# Altium schematic sheet Motor-Supply-Section.SchDoc
size A4; DocumentNumber: 4; SheetNumber: 4; SheetTotal: 10
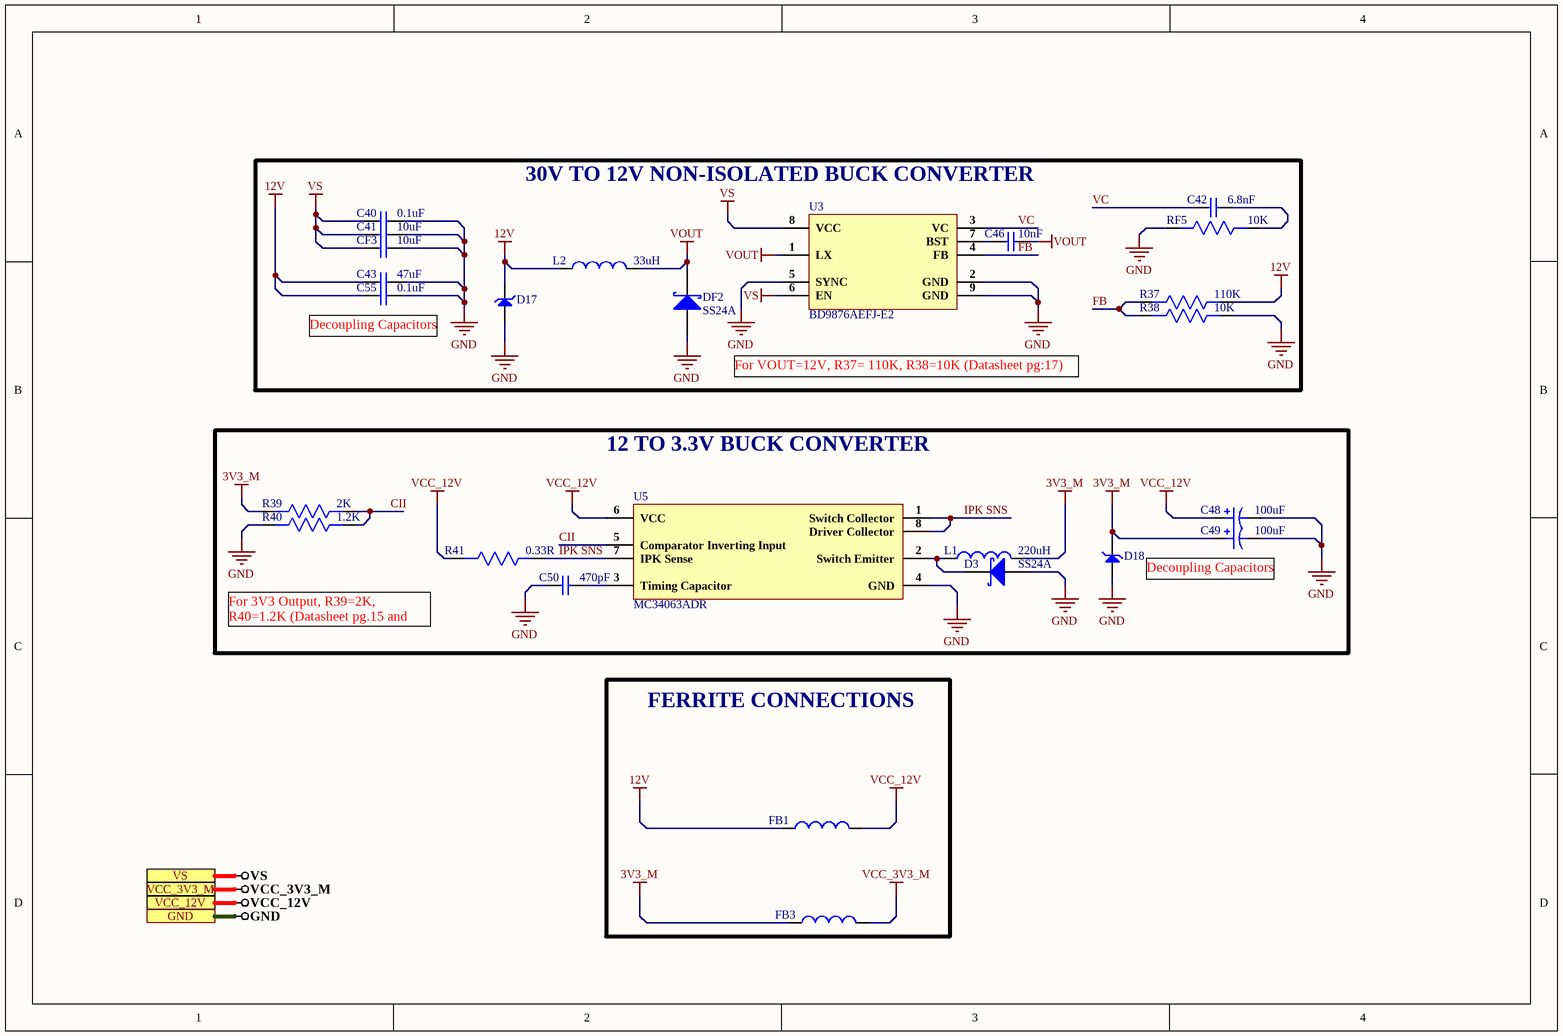
[diagram p0: Motor-Supply-Section.SchDoc]

## Parts
C40  0.1uF  [Cap 0603]
C41  10uF  [Cap 0603]
C42  6.8nF  [Cap 0603]
C43  47uF  [Cap1206]
C46  10nF  [Cap 0402]
C48  100uF  [CAP- 2917]
C49  100uF  [CAP- 2917]
C50  470pF  [Cap 0603]
C55  0.1uF  [Cap 0603]
CF3  10uF  [Cap 0603]
D3  SS24A  [SMA]
D17  MSMP12A-M3/89A  [MicroSMP]  (value not drawn)
D18  MSP3V3HM3/89A  [MicroSMP]  (value not drawn)
DF2  SS24A  [SMA]
FB1  MPZ1608S121ATDH5  [MPZ1608S121ATDH5]  (value not drawn)
FB3  MPZ1608S121ATDH5  [MPZ1608S121ATDH5]  (value not drawn)
L1  220uH  [SLF12575T-221M1R3-PF]
L2  33uH  [PNLS5020-330]
R37  110K  [Res0603]
R38  10K  [Res0603]
R39  2K  [Res0603]
R40  1.2K  [Res0603]
R41  0.33R  [Res0603]
RF5  10K  [Res0603]
U3  BD9876AEFJ-E2  [8-HTSOP-J]
U5  MC34063ADR  [SOIC-8]

## Blocks framed on the sheet
30V TO 12V NON-ISOLATED BUCK CONVERTER: C40-C43 C46 C55 CF3 D17 DF2 L2 R37 R38 RF5 U3
12 TO 3.3V BUCK CONVERTER: C48-C50 D3 D18 L1 R39-R41 U5
FERRITE CONNECTIONS: FB1 FB3

## Ports
GND, VCC_3V3_M, VCC_12V, VS

## Nets
3V3_M: C49.1 D18.2(K) FB3.1 L1.2 R39.2
12V: C43.1 C55.1 D17.2(K) FB1.1 L2.1 R37.1
GND: C40.2 C41.2 C43.2 C48.2 C49.2 C50.1 C55.2 CF3.2 D3.2(A) D17.1(A) D18.1(A) DF2.2(A) R38.1 R40.2 RF5.2 U3.2(GND) U3.5(SYNC) U3.9(GND) U5.4(GND) ; port GND
VCC_3V3_M: FB3.2 ; port VCC_3V3_M
VCC_12V: C48.1 FB1.2 R41.2 U5.6(VCC) ; port VCC_12V
VOUT: C46.2 DF2.1(K) L2.2 U3.1(LX)
VS: C40.1 C41.1 CF3.1 U3.6(EN) U3.8(VCC) ; port VS
CII: R39.1 R40.1 U5.5(Comparator_Inverting_Input)
FB: R37.2 R38.2 U3.4(FB)
IPK SNS: R41.1 U5.1(Switch_Collector) U5.7(IPK_Sense) U5.8(Driver_Collector)
VC: C42.1 U3.3(VC)
NetC42_2: C42.2 RF5.1
NetC46_1: C46.1 U3.7(BST)
NetC50_2: C50.2 U5.3(Timing_Capacitor)
NetD3_1: D3.1(K) L1.1 U5.2(Switch_Emitter)

## Notes on the sheet
- Decoupling Capacitors
- For VOUT=12V, R37= 110K, R38=10K (Datasheet pg:17)
- For 3V3 Output, R39=2K, R40=1.2K (Datasheet pg.15 and pg.16)

## Library data of the parts
C40 C55 = CL10B104KB8NNNC: Cap Ceramic 0.1uF 50VDC X7R 10% SMD 0603 Paper T/R; Manufacturer: Samsung; Capacitance: 100nF; Voltage Rating: 50V; Supplier 1: Digi-Key; Manufacturer Part Number: CL10B104KB8NNNC; RoHS: Yes; Category: Ceramic Capacitors; Stock 1: 3998791; Pricing 1: 1=0.10000, 10=0.03000, 50=0.01640, 100=0.01340, 500=0.00954, 1000=0.00750 (USD); Mount: Surface Mount; Case/Package: 0603; Case Code (Metric): 1608; Case Code (Imperial): 0603; Material: Ceramic; Contact Plating: Tin; Min Operating Temperature: -55°C; Max Operating Temperature: 125°C; Dielectric: X7R; Tolerance: 10%; Package Quantity: 1; Packaging: Tape and Reel; Voltage: 50V; Voltage Rating (DC): 50V; Series: CL; Construction: Flat; Length: 1.6mm; Width: 0.031inch; Height: 0.8mm; Depth: 0.8mm; Thickness: 0.035inch; Radiation Hardening: No; Lead Free: Lead Free; RoHS Compliant: Yes; ComponentLink1URL: https://datasheet.ciiva.com/25803/cl10b104kb8nnnc-25803393.pdf?src-supplier=Digi-Key; ComponentLink1Description: https://datasheet.ciiva.com/25803/cl10b104kb8nnnc-25803393.pdf?src-supplier=Digi-Key; ComponentLink2URL: https://datasheet.ciiva.com/26838/getdatasheetpartid-89097-26838411.pdf?src-supplier=Verical; ComponentLink2Description: https://datasheet.ciiva.com/26838/getdatasheetpartid-89097-26838411.pdf?src-supplier=Verical; ComponentLink3URL: https://datasheet.ciiva.com/29198/456651-da-01-en-vs-kondensator-0605-29198839.pdf?src-supplier=Conrad; ComponentLink3Description: https://datasheet.ciiva.com/29198/456651-da-01-en-vs-kondensator-0605-29198839.pdf?src-supplier=Conrad; Supplier Part Number 1: 1276-1000-1-ND
C41 CF3 = GRM188R6YA106MA73D: 10uF 35V X5R 20% Pad SMD 0603; Manufacturer: Murata; Supplier 1: Arrow Electronics; Manufacturer Part Number: GRM188R6YA106MA73D; RoHS: Yes; Category: Ceramic Capacitors; Stock 1: 37601; Pricing 1: 1=0.36650, 10=0.23380, 25=0.23160, 100=0.15050, 250=0.14890, 500=0.10700, 1000=0.09270, 3000=0.08640, 6000=0.07720, 15000=0.07140, 30000=0.05840 (USD); Mount: Surface Mount; Case/Package: 0603; Case Code (Metric): 1608; Case Code (Imperial): 0603; Min Operating Temperature: -55°C; Max Operating Temperature: 85°C; Packaging: Tape and Reel; Capacitance: 10uF; Voltage Rating: 35V; Tolerance: 20%; Voltage Rating (DC): 35V; Dielectric: X5R; Length: 0.063inch; Width: 0.031inch; Thickness: 0.039inch; RoHS Compliant: Yes; ComponentLink1URL: http://search.murata.co.jp/Ceramy/image/img/A01X/G101/ENG/GRM188R6YA106MA73-01.pdf?src-supplier=Future+Electronics; ComponentLink1Description: http://search.murata.co.jp/Ceramy/image/img/A01X/G101/ENG/GRM188R6YA106MA73-01.pdf?src-supplier=Future+Electronics; ComponentLink2URL: http://search.murata.co.jp/Ceramy/image/img/A01X/G101/ENG/GRM188R6YA106MA73-01.pdf?src-supplier=Digi-Key; ComponentLink2Description: http://search.murata.co.jp/Ceramy/image/img/A01X/G101/ENG/GRM188R6YA106MA73-01.pdf?src-supplier=Digi-Key; ComponentLink3URL: https://www.murata.com/~/media/webrenewal/support/library/catalog/products/capacitor/mlcc/c02e.ashx?la=en-us&src-supplier=Digi-Key; ComponentLink3Description: https://www.murata.com/~/media/webrenewal/support/library/catalog/products/capacitor/mlcc/c02e.ashx?la=en-us&src-supplier=Digi-Key; ComponentLink4URL: http://search.murata.co.jp/Ceramy/image/img/A01X/G101/ENG/GRM188R6YA106MA73-01.pdf?src-supplier=Mouser; ComponentLink4Description: http://search.murata.co.jp/Ceramy/image/img/A01X/G101/ENG/GRM188R6YA106MA73-01.pdf?src-supplier=Mouser; ComponentLink5URL: http://search.murata.co.jp/Ceramy/image/img/A01X/G101/ENG/GRM188R6YA106MA73-01.pdf?src-supplier=TTI; ComponentLink5Description: http://search.murata.co.jp/Ceramy/image/img/A01X/G101/ENG/GRM188R6YA106MA73-01.pdf?src-supplier=TTI; Supplier Part Number 1: GRM188R6YA106MA73D
C42 = 0603B682K500NT: 50V 6.8nF X7R ±10% 0603; Manufacturer: FH; ComponentLink1Description: LCSC; ComponentLink1URL: https://www.lcsc.com/product-detail/Multilayer-Ceramic-Capacitors-MLCC-SMD-SMT_FH-Guangdong-Fenghua-Advanced-Tech-0603B682K500NT_C1631.html; Manufacturer Part Number: 0603B682K500NT; Footprint: 0603; Value: 6.8nF
C43 = GRM31CR61E476ME44L: CAP CER 1206 47 uF 25 V ±20 % Tol. X5R; Manufacturer: Murata; Tolerance: 20%; Voltage Rating (DC): 25V; Supplier 1: Digi-Key; Manufacturer Part Number: GRM31CR61E476ME44L; RoHS: Yes; Category: Ceramic Capacitors; Capacitance: 47uF; Dielectric: X5R; Length: 3.2mm; Width: 1.6mm; Thickness: 1.6mm; ComponentLink1URL: https://search.murata.co.jp/Ceramy/image/img/A01X/partnumbering_e_01.pdf?src-supplier=Digi-Key; ComponentLink1Description: https://search.murata.co.jp/Ceramy/image/img/A01X/partnumbering_e_01.pdf?src-supplier=Digi-Key; Supplier Part Number 1: 490-16268-2-ND
C46 = CC0402KRX7R8BB103: CAP CER 10000PF 25V X7R 0402; Manufacturer: Yageo; Tolerance: 10%; Supplier 1: Digi-Key; Manufacturer Part Number: CC0402KRX7R8BB103; Stock 1: 0; Pricing 1: 1=0.1, 10=0.021, 100=0.0093, 500=0.00666, 1000=0.00523, 2500=0.00476, 5000=0.00438 (USD); Mount: Surface Mount; Case/Package: 0402; Case Code (Metric): 1005; Case Code (Imperial): 0402; Min Operating Temperature: -55°C; Max Operating Temperature: 125°C; Capacitance: 10nF; Dielectric: X7R; Voltage Rating: 25V; Package Quantity: 1; Packaging: Tape and Reel; Voltage Rating (DC): 25V; Termination: SMD/SMT; Composition: Ceramic; Length: 1mm; Height: 0.5mm; Depth: 0.5mm; Width: 0.02inch; Thickness: 0.022inch; Radiation Hardening: No; REACH SVHC: Unknown; Lead Free: Lead Free; Halogen Free: Halogen Free; ComponentLink1URL: http://www.yageo.com/documents/recent/UPY-GPHC_X7R_6.3V-to-50V_18.pdf?src-supplier=Digi-Key; ComponentLink1Description: http://www.yageo.com/documents/recent/UPY-GPHC_X7R_6.3V-to-50V_18.pdf?src-supplier=Digi-Key; ComponentLink2URL: https://www.verical.com/server-webapp/html/getDatasheet?partID=375418&src-supplier=Verical; ComponentLink2Description: https://www.verical.com/server-webapp/html/getDatasheet?partID=375418&src-supplier=Verical; ComponentLink3URL: http://www.yageo.com/documents/recent/UPY-GPHC_X7R_6.3V-to-50V_8.pdf?src-supplier=Avnet; ComponentLink3Description: http://www.yageo.com/documents/recent/UPY-GPHC_X7R_6.3V-to-50V_8.pdf?src-supplier=Avnet; ComponentLink4URL: https://4donline.ihs.com/images/VipMasterIC/IC/YAGO/YAGO-S-A0003557223/YAGO-S-A0003557223-1.pdf?hkey=52A5661711E402568146F3353EA87419&src-supplier=Element14; ComponentLink4Description: https://4donline.ihs.com/images/VipMasterIC/IC/YAGO/YAGO-S-A0003557223/YAGO-S-A0003557223-1.pdf?hkey=52A5661711E402568146F3353EA87419&src-supplier=Element14; ComponentLink5URL: http://www.farnell.com/datasheets/2167236.pdf?src-supplier=Element14; ComponentLink5Description: http://www.farnell.com/datasheets/2167236.pdf?src-supplier=Element14; ComponentLink6URL: http://www.mouser.com/ds/2/447/Yageo_UPY-GP_NP0_16V-to-50V_9-358835.pdf?src-supplier=Mouser; ComponentLink6Description: http://www.mouser.com/ds/2/447/Yageo_UPY-GP_NP0_16V-to-50V_9-358835.pdf?src-supplier=Mouser; Supplier Part Number 1: 311-1337-1-ND
C48 C49 = TAJE107M025RNJ: CAP TANT 100UF 20% 25V 2917; Manufacturer: Kyocera AVX; ESR (Equivalent Series Resistance): 300mR; Leakage Current: 25uA; Polarity: Polar; Dissipation Factor: 10%; Supplier 1: Mouser; Manufacturer Part Number: TAJE107M025RNJ; RoHS: Yes; Category: Tantalum Capacitors; Stock 1: 109; Pricing 1: 1=2.81000, 10=2.81000, 50=2.81000, 100=2.19000, 1000=1.76000, 10000=1.76000 (USD); Mount: Surface Mount; Case/Package: 2917; Number of Pins: 2; Case Code (Imperial): 2917; Case Code (Metric): 7343; Min Operating Temperature: -55°C; Max Operating Temperature: 125°C; Capacitance: 100uF; Tolerance: 20%; Packaging: Tape and Reel; Voltage Rating: 25V; Voltage Rating (DC): 25V; Features: General Purpose; Package Quantity: 1; Termination: SMD/SMT; Series: TAJ; Construction: Flat; Length: 7.3mm; Width: 4.3mm; Height: 4.3mm; Depth: 4.3mm; Height - Seated (Max): 0.169inch; Radiation Hardening: No; Lead Free: Lead Free; RoHS Compliant: Yes; REACH SVHC: No SVHC; ComponentLink1URL: https://datasheet.ciiva.com/26787/taje107m025rnj-26787048.pdf?src-supplier=IIIC; ComponentLink1Description: https://datasheet.ciiva.com/26787/taje107m025rnj-26787048.pdf?src-supplier=IIIC; ComponentLink2URL: https://datasheet.ciiva.com/265/taj-265541.pdf?src-supplier=Digi-Key; ComponentLink2Description: https://datasheet.ciiva.com/265/taj-265541.pdf?src-supplier=Digi-Key; ComponentLink3URL: https://datasheet.ciiva.com/265/taj-265542.pdf?src-supplier=Digi-Key; ComponentLink3Description: https://datasheet.ciiva.com/265/taj-265542.pdf?src-supplier=Digi-Key; ComponentLink4URL: https://datasheet.ciiva.com/265/taj-265540.pdf?src-supplier=Digi-Key; ComponentLink4Description: https://datasheet.ciiva.com/265/taj-265540.pdf?src-supplier=Digi-Key; ComponentLink5URL: https://datasheet.ciiva.com/28609/1719052-28609254.pdf?src-supplier=Element14; ComponentLink5Description: https://datasheet.ciiva.com/28609/1719052-28609254.pdf?src-supplier=Element14; ComponentLink6URL: https://datasheet.ciiva.com/11230/taj-11230456.pdf?src-supplier=Avnet; ComponentLink6Description: https://datasheet.ciiva.com/11230/taj-11230456.pdf?src-supplier=Avnet; ComponentLink7URL: https://datasheet.ciiva.com/17339/taj-17339677.pdf?src-supplier=Avnet+Europe; ComponentLink7Description: https://datasheet.ciiva.com/17339/taj-17339677.pdf?src-supplier=Avnet+Europe; ComponentLink8URL: https://datasheet.ciiva.com/22667/1719052-22667581.pdf?src-supplier=Element14; ComponentLink8Description: https://datasheet.ciiva.com/22667/1719052-22667581.pdf?src-supplier=Element14; Supplier Part Number 1: 581-TAJE107M025RNJ
C50 = CC0603KRX7R9BB471: CAP CER 470pF 10% X7R 50V 0603 SMD; Manufacturer: Yageo; Dielectric Material: Ceramic; Insulation Resistance: 10GR; Dissipation Factor: 2.5%; Supplier 1: Digi-Key; Manufacturer Part Number: CC0603KRX7R9BB471; RoHS: Yes; Category: Ceramic Capacitors; Stock 1: 2173; Pricing 1: 1=0.10000, 10=0.04500, 50=0.02460, 100=0.02010, 500=0.01432, 1000=0.01125 (USD); Mount: Surface Mount; Case/Package: 0603; Number of Pins: 2; Case Code (Imperial): 0603; Case Code (Metric): 1608; Min Operating Temperature: -55°C; Max Operating Temperature: 125°C; Capacitance: 470pF; Tolerance: 10%; Dielectric: X7R; Series: CC; Voltage Rating: 50V; Voltage Rating (DC): 50V; Packaging: Tape and Reel; Package Quantity: 1; Termination: SMD/SMT; Resistor Type: Ceramic; Length: 1.6mm; Width: 0.8mm; Height: 0.8mm; Depth: 0.8mm; Thickness: 0.035inch; Radiation Hardening: No; RoHS Compliant: Yes; REACH SVHC: No SVHC; Lead Free: Lead Free; Halogen Free: Halogen Free; ComponentLink1URL: https://datasheet.ciiva.com/5425/upy-gphc-x7r-6-3v-to-50v-8-12304-5425461.pdf?src-supplier=Mouser; ComponentLink1Description: https://datasheet.ciiva.com/5425/upy-gphc-x7r-6-3v-to-50v-8-12304-5425461.pdf?src-supplier=Mouser; ComponentLink2URL: https://datasheet.ciiva.com/144/mlccorderingcode-144439.pdf?src-supplier=Digi-Key; ComponentLink2Description: https://datasheet.ciiva.com/144/mlccorderingcode-144439.pdf?src-supplier=Digi-Key; ComponentLink3URL: https://datasheet.ciiva.com/144/mlccorderingcode-144440.pdf?src-supplier=Digi-Key; ComponentLink3Description: https://datasheet.ciiva.com/144/mlccorderingcode-144440.pdf?src-supplier=Digi-Key; ComponentLink4URL: https://datasheet.ciiva.com/11587/upy-gphc-x7r-6-3v-to-50v-8-11587224.pdf?src-supplier=Avnet; ComponentLink4Description: https://datasheet.ciiva.com/11587/upy-gphc-x7r-6-3v-to-50v-8-11587224.pdf?src-supplier=Avnet; ComponentLink5URL: https://datasheet.ciiva.com/144/mlccorderingcode-144441.pdf?src-supplier=Digi-Key; ComponentLink5Description: https://datasheet.ciiva.com/144/mlccorderingcode-144441.pdf?src-supplier=Digi-Key; ComponentLink6URL: https://datasheet.ciiva.com/16623/upy-gphc-x7r-6-3v-to-50v-8-16623897.pdf?src-supplier=Avnet+Europe; ComponentLink6Description: https://datasheet.ciiva.com/16623/upy-gphc-x7r-6-3v-to-50v-8-16623897.pdf?src-supplier=Avnet+Europe; ComponentLink7URL: https://datasheet.ciiva.com/8033/1489800-8033898.pdf?src-supplier=Element14; ComponentLink7Description: https://datasheet.ciiva.com/8033/1489800-8033898.pdf?src-supplier=Element14; ComponentLink8URL: https://datasheet.ciiva.com/8033/1489800-8033899.pdf?src-supplier=Element14; ComponentLink8Description: https://datasheet.ciiva.com/8033/1489800-8033899.pdf?src-supplier=Element14; ComponentLink9URL: https://datasheet.ciiva.com/26829/getdatasheetpartid-251791-26829452.pdf?src-supplier=Verical; ComponentLink9Description: https://datasheet.ciiva.com/26829/getdatasheetpartid-251791-26829452.pdf?src-supplier=Verical; ComponentLink10URL: https://datasheet.ciiva.com/28450/1489800-28450652.pdf?src-supplier=Element14; ComponentLink10Description: https://datasheet.ciiva.com/28450/1489800-28450652.pdf?src-supplier=Element14; ComponentLink11URL: https://datasheet.ciiva.com/8033/70765-8033902.pdf?src-supplier=Element14; ComponentLink11Description: https://datasheet.ciiva.com/8033/70765-8033902.pdf?src-supplier=Element14; Supplier Part Number 1: 311-1078-1-ND
D3 DF2 = SS24A: 40V 500mV@2A 2A SMA(DO-214AC) Schottky Barrier Diodes (SBD) ROHS; Manufacturer: Yangzhou; Manufacturer Part No: SS24A; Package: SMA(DO-214AC)
D17 = MSMP12A-M3/89A: TVS DIODE 12VWM 19.9VC MICROSMP; Number of Unidirectional Channels: 1; Reverse Standoff Voltage: 12V; Min Breakdown Voltage: 13.3V; Peak Pulse Power: 150W; Power Line Protection: No; Peak Pulse Current: 7.5A; Diode Type: ZENER; LCSC Part Number: C1973858; Item Type: TVS Diode; ComponentLink1Description: LCSC; Supplier: Mouser; Supplier Part Number: 78-MSMP12A-M389A; RoHS: Yes; Category: TVS Diodes; Stock: 17037; Pricing: 1=0.36, 10=0.294, 50=0.294, 100=0.118, 1000=0.069, 10000=0.048 (USD); Mounting Technology: Surface Mount; Min Operating Temperature: -55°C; Max Operating Temperature: 150°C; Packaging: Tape and Reel; Series: TransZorb®; RoHS Compliant: Yes; ComponentLink2URL: http://www.vishay.com/docs/89457/mspm6a.pdf?src-supplier=Digi-Key; ComponentLink2Description: http://www.vishay.com/docs/89457/mspm6a.pdf?src-supplier=Digi-Key; ComponentLink3URL: http://www.vishay.com/docs/89457/msmp6athrumsmp20a.pdf?src-supplier=Digi-Key; ComponentLink3Description: http://www.vishay.com/docs/89457/msmp6athrumsmp20a.pdf?src-supplier=Digi-Key
D18 = MSP3V3HM3/89A: TVS DIODE 3.3VWM 11.5VC MICROSMP; Direction: Unidirectional; Operating Supply Voltage: 3.3V; Max Surge Current: 75A; Breakdown Voltage: 4.1V; Clamping Voltage: 11V; Peak Pulse Power: 150W; Number of Unidirectional Channels: 1; Power Line Protection: No; Peak Pulse Current: 87A; Test Current: 1mA; Max Reverse Leakage Current: 200uA; Diode Type: ZENER; LCSC Part Number: C241899; Item Type: TVS Diode; ComponentLink1Description: LCSC; Supplier: Mouser; Supplier Part Number: 625-MSP3V3HM3; RoHS: Yes; Category: TVS Diodes; Stock: 15021; Pricing: 1=0.39, 10=0.313, 50=0.313, 100=0.165, 1000=0.068, 10000=0.05 (USD); Mounting Technology: Surface Mount; Min Operating Temperature: -55°C; Max Operating Temperature: 150°C; Packaging: Tape and Reel; Package Quantity: 4500; Polarity: Unidirectional; Reverse Standoff Voltage: 3.3V; Min Breakdown Voltage: 4.1V; Series: Automotive, AEC-Q101, TransZorb®, eSMP™; RoHS Compliant: Yes; ComponentLink2URL: https://datasheet.ciiva.com/14080/msp3v3-14080471.pdf?src-supplier=Digi-Key; ComponentLink2Description: https://datasheet.ciiva.com/14080/msp3v3-14080471.pdf?src-supplier=Digi-Key
FB1 FB3 = MPZ1608S121ATDH5: Ferrite Beads Multi-Layer 120Ohm 25% 100MHz 2A 45mOhm DCR 0603 Automotive T/R; Manufacturer: TDK; Number of Lines: 1; DC Resistance (DCR): 45mR; Impedance: 120R; Supplier 1: Digi-Key; Manufacturer Part Number: MPZ1608S121ATDH5; RoHS: Yes; Category: Ferrite Beads and Chips; Pricing 1: 1=0.11000, 10=0.08600, 25=0.07720, 50=0.05660, 100=0.04890, 250=0.03860, 500=0.03260, 1000=0.02746 (USD); Mount: Surface Mount; Case/Package: 0603; Case Code (Metric): 1608; Case Code (Imperial): 0603; Weight: 7.1E-05oz; Min Operating Temperature: -55°C; Max Operating Temperature: 125°C; Package Quantity: 4000; Packaging: Tape and Reel; Max Current Rating: 2A; Termination: SMD/SMT; Max DC Current: 2A; Tolerance: 25%; Test Frequency: 100MHz; Length: 0.063inch; Width: 0.031inch; Height: 0.03inch; Ratings: AEC-Q200; RoHS Compliant: Yes; ComponentLink1URL: https://media.digikey.com/pdf/Data%20Sheets/TDK%20PDFs/MPZ_Series_Br.pdf?src-supplier=Digi-Key; ComponentLink1Description: https://media.digikey.com/pdf/Data%20Sheets/TDK%20PDFs/MPZ_Series_Br.pdf?src-supplier=Digi-Key; ComponentLink2URL: http://www.mouser.com/ds/2/400/eads_commercial_power_mpz1608_en-923650.pdf?src-supplier=Mouser; ComponentLink2Description: http://www.mouser.com/ds/2/400/eads_commercial_power_mpz1608_en-923650.pdf?src-supplier=Mouser; ComponentLink3URL: https://product.tdk.com/info/en/catalog/datasheets/beads_automotive_power_mpz1608_en.pdf?src-supplier=Digi-Key; ComponentLink3Description: https://product.tdk.com/info/en/catalog/datasheets/beads_automotive_power_mpz1608_en.pdf?src-supplier=Digi-Key; Supplier Part Number 1: 445-172891-6-ND
L1 = SLF12575T-221M1R3-PF: Inductor Power Shielded Wirewound 220uH 20% 1KHz Ferrite 1.3A 310mOhm DCR Blister T/R; Manufacturer: TDK; DC Resistance (DCR): 310mR; Supplier 1: Digi-Key; Manufacturer Part Number: SLF12575T-221M1R3-PF; RoHS: Yes; Category: Fixed Inductors; Stock 1: 1079; Pricing 1: 1=1.97000, 10=1.81500, 25=1.66360, 50=1.42180, 100=1.27050, 250=1.08900 (USD); Mount: Surface Mount; Case/Package: Nonstandard; Core Material: Ferrite; Min Operating Temperature: -20°C; Max Operating Temperature: 105°C; Package Quantity: 500; Packaging: Tape and Reel; Tolerance: 20%; Shielding: Shielded; Inductance: 220uH; Current Rating: 1.3A; Saturation Current: 1.3A; Max DC Current: 1.3A; Termination: SMD/SMT; Resistor Type: Wirewound; Test Frequency: 1kHz; DC Current: 1.3A; Series: SLF; Length: 12.5mm; Width: 12.5mm; Height: 0.295inch; Height - Seated (Max): 0.309inch; Depth: 12.8mm; Military Standard: Not; Lead Free: Lead Free; RoHS Compliant: Yes; ComponentLink1URL: https://datasheet.ciiva.com/11802/0900766b812b7d4f-11802208.pdf?src-supplier=RSComponents; ComponentLink1Description: https://datasheet.ciiva.com/11802/0900766b812b7d4f-11802208.pdf?src-supplier=RSComponents; Supplier Part Number 1: 445-174412-1-ND
L2 = PNLS5020-330: 1A 33uH ±20% 356mΩ SMD,5x5x2mm Power Inductors ROHS; Manufacturer: DMBJ; Manufacturer Part Number: PNLS5020-330; Footprint: Custom; ComponentLink1Description: LCSC; ComponentLink1URL: https://www.lcsc.com/product-detail/Power-Inductors_DMBJ-PNLS5020-330_C2849490.html
R37 = 0603WAD1103T5E: 110kΩ 0603 Chip Resistor - Surface Mount ROHS; Manufacturer: UNI-ROYAL; ComponentLink1Description: LCSC; ComponentLink1URL: https://www.lcsc.com/product-detail/Chip-Resistor-Surface-Mount_UNI-ROYAL-Uniroyal-Elec-0603WAD1103T5E_C423090.html; Manufacturer Part Number: 0603WAD1103T5E; Value: 110K; Footprint: 0603
R38 RF5 = RC0603FR-0710KL: RES SMD 10K Ohm 1% 1/10W 0603; Manufacturer: Yageo; Resistance: 10kR; Temperature Coefficient: 100ppm/°C; Voltage Rating (DC): 50V; Power Rating: 100mW; Voltage Rating: 75V; Supplier 1: Digi-Key; Manufacturer Part Number: RC0603FR-0710KL; RoHS: Yes; Category: Chip SMD Resistors; Stock 1: 25249139; Pricing 1: 1=0.10000, 10=0.02400, 100=0.00970, 1000=0.00436, 2500=0.00378 (USD); Case/Package: 0603; Number of Pins: 2; Case Code (Imperial): 0603; Case Code (Metric): 1608; Weight: 7.1E-05oz; Size Code: 0603; Min Operating Temperature: -55°C; Max Operating Temperature: 155°C; Tolerance: 1%; Resistor Type: Thick Film; Packaging: Tape and Reel; Termination: SMD/SMT; Features: Moisture Resistant; Series: RC; Max Power Dissipation: 100mW; Number of Terminations: 2; Resistance Tolerance: 1%; Construction: Rectangular; Length: 1.6mm; Width: 0.8mm; Height: 0.45mm; Depth: 0.8mm; Lead Pitch: 0.3mm; REACH SVHC: Unknown; Lead Free: Lead Free; Military Standard: Not; RoHS Compliant: Yes; ComponentLink1URL: https://datasheet.ciiva.com/7660/38590-7660789.pdf?src-supplier=Element14; ComponentLink1Description: https://datasheet.ciiva.com/7660/38590-7660789.pdf?src-supplier=Element14; ComponentLink2URL: https://datasheet.ciiva.com/7983/443971-7983596.pdf?src-supplier=Element14; ComponentLink2Description: https://datasheet.ciiva.com/7983/443971-7983596.pdf?src-supplier=Element14; ComponentLink3URL: https://datasheet.ciiva.com/22747/443971-22747519.pdf?src-supplier=Element14; ComponentLink3Description: https://datasheet.ciiva.com/22747/443971-22747519.pdf?src-supplier=Element14; ComponentLink4URL: https://datasheet.ciiva.com/46440/1868787-46440891.pdf?src-supplier=Element14; ComponentLink4Description: https://datasheet.ciiva.com/46440/1868787-46440891.pdf?src-supplier=Element14; ComponentLink5URL: https://datasheet.ciiva.com/7746/1738695-7746239.pdf?src-supplier=Element14; ComponentLink5Description: https://datasheet.ciiva.com/7746/1738695-7746239.pdf?src-supplier=Element14; ComponentLink6URL: https://datasheet.ciiva.com/15189/getdatasheetpartid-409289-15189591.pdf?src-supplier=Verical; ComponentLink6Description: https://datasheet.ciiva.com/15189/getdatasheetpartid-409289-15189591.pdf?src-supplier=Verical; Supplier Part Number 1: 311-10.0KHRCT-ND
R39 = RC0603FR-072KL: RES SMD 2K OHM 1% 1/10W 0603; Manufacturer: Yageo; Resistance: 2kR; Temperature Coefficient: 100ppm/°C; Voltage Rating (DC): 50V; Power Rating: 100mW; Working Voltage: 75V; Supplier 1: Digi-Key; Manufacturer Part Number: RC0603FR-072KL; Stock 1: 8782961; Pricing 1: 1=0.1, 10=0.023, 100=0.0094, 1000=0.00421, 2500=0.00366 (USD); Case/Package: 0603; Number of Pins: 2; Case Code (Metric): 1608; Case Code (Imperial): 0603; Min Operating Temperature: -55°C; Max Operating Temperature: 155°C; Tolerance: 1%; Composition: Thick Film; Packaging: Tape and Reel; Voltage Rating: 50V; Package Quantity: 1; Number of Terminations: 2; Termination: SMD/SMT; Military Standard: Not; Max Power Dissipation: 100mW; Features: Moisture Resistant; Length: 1.6mm; Height: 0.45mm; Width: 0.031inch; Depth: 0.8mm; Lead Free: Lead Free; REACH SVHC: No SVHC; ComponentLink1URL: http://www.farnell.com/datasheets/2167052.pdf?src-supplier=Element14; ComponentLink1Description: http://www.farnell.com/datasheets/2167052.pdf?src-supplier=Element14; ComponentLink2URL: http://documents.rs-components.com/techlib://itc_doclist_GB.htm?stockno=5050139&src-supplier=RSComponents; ComponentLink2Description: http://documents.rs-components.com/techlib://itc_doclist_GB.htm?stockno=5050139&src-supplier=RSComponents; ComponentLink3URL: http://www.yageo.com/documents/recent/PYu-RC_Group_51_RoHS_L_10.pdf?src-supplier=Digi-Key; ComponentLink3Description: http://www.yageo.com/documents/recent/PYu-RC_Group_51_RoHS_L_10.pdf?src-supplier=Digi-Key; ComponentLink4URL: http://www.mouser.com/catalog/specsheets/RC0603.pdf?src-supplier=Mouser; ComponentLink4Description: http://www.mouser.com/catalog/specsheets/RC0603.pdf?src-supplier=Mouser; Supplier Part Number 1: 311-2.00KHRCT-ND
R40 = 0603WAF1201T5E: ±1% 1/10W Thick Film Resistors 75V ±100ppm/℃ -55℃~+155℃ 1.2kΩ 0603 Chip Resistor - Surface Mount ROHS; Manufacturer: UNI-ROYAL; Manufacturer Part No: 0603WAF1201T5E; Value: 1.2kΩ; Package: 0603
R41 = RTT03R330FTP: ±1% 1/10W Thick Film Resistors 75V ±600ppm/℃ -55℃~+155℃ 0.33Ω 0603 Chip Resistor - Surface Mount ROHS; Manufacturer: RALEC; Manufacturer Part No: RTT03R330FTP; Value: 0.33Ω; Package: 0603
U3 = BD9876AEFJ-E2: NO Step-down type 1 Step-down 1V~29.4V 7V~42V 3A 300kHz SOIC-8_EP_150mil DC-DC Converters ROHS; Manufacturer: ROHM Semicon; Manufacturer Part Number: BD9876AEFJ-E2; ComponentLink1Description: LCSC; ComponentLink1URL: https://www.lcsc.com/product-detail/DC-DC-Converters_ROHM-Semicon-BD9876AEFJ-E2_C79958.html; Footprint: SOIC-8_EP_150mil
U5 = MC34063ADR: 1.5-A boost, buck, inverting switching regulator, operation from 0°C to 70°C 8-SOIC 0 to 70; Manufacturer: Texas Instruments; Output Voltage: 40V; Number of Outputs: 1; Output Current: 1.5A; Switching Frequency: 100kHz; Synchronous Rectifier: No; Output Type: Adjustable; Max Output Current: 750mA; Min Input Voltage: 3V; Min Output Voltage: 1.55V; Quiescent Current: 4mA; Topology: Flyback,SEPIC; Supplier 1: Digi-Key; Manufacturer Part Number: MC34063ADR; RoHS: Yes; Category: Power Supply Modules; Stock 1: 17204; Pricing 1: 1=0.78000, 10=0.68400, 25=0.64240, 100=0.52420, 250=0.48688, 500=0.41438, 1000=0.34206 (USD); Case/Package: D; Number of Pins: 8; Weight: 0.002561oz; Contact Plating: Gold; Min Operating Temperature: 0°C; Max Operating Temperature: 70°C; Packaging: Tape and Reel; Package Quantity: 1; Max Input Voltage: 40V; Max Output Voltage: 40V; Termination: SMD/SMT; Radiation Hardening: No; RoHS Compliant: Yes; Lead Free: Lead Free; REACH SVHC: No SVHC; ComponentLink1URL: https://datasheet.ciiva.com/7408/1862376-7408060.pdf?src-supplier=Newark; ComponentLink1Description: https://datasheet.ciiva.com/7408/1862376-7408060.pdf?src-supplier=Newark; ComponentLink2URL: https://datasheet.ciiva.com/2025/mc33063a-2025162.pdf?src-supplier=Digi-Key; ComponentLink2Description: https://datasheet.ciiva.com/2025/mc33063a-2025162.pdf?src-supplier=Digi-Key; ComponentLink3URL: https://datasheet.ciiva.com/2025/mc33063a-2025161.pdf?src-supplier=Digi-Key; ComponentLink3Description: https://datasheet.ciiva.com/2025/mc33063a-2025161.pdf?src-supplier=Digi-Key; ComponentLink4URL: https://datasheet.ciiva.com/2025/mc33063a-2025163.pdf?src-supplier=Digi-Key; ComponentLink4Description: https://datasheet.ciiva.com/2025/mc33063a-2025163.pdf?src-supplier=Digi-Key; Supplier Part Number 1: 296-17765-1-ND